# EAGLE schematic Centinel_IO_adap (EAGLE 9.4.2)
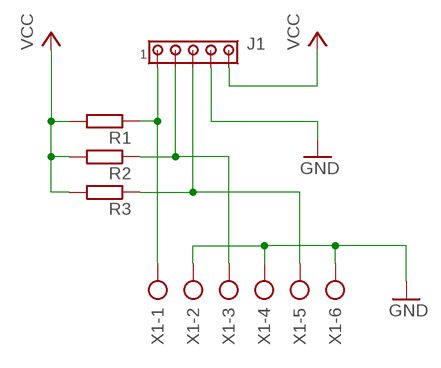
[diagram p0: schematic, sheet 1]

## Parts
J1  MTA05-156  [1X5MTA]
R1  R-EU_0207/7  [0207/7]
R2  R-EU_0207/7  [0207/7]
R3  R-EU_0207/7  [0207/7]
X1  AK500/6  [AK500/6]

## Nets
GND: J1.4 X1.2 X1.4 X1.6
N$1: J1.1 R1.1 X1.1
N$2: J1.2 R2.1 X1.3
N$3: J1.3 R3.1 X1.5
VCC: J1.5 R1.2 R2.2 R3.2

## Library data of the parts
J1 = con-amp:MTA05-156: AMP connector
R1-R3 = rcl:R-EU_: RESISTOR, European symbol; SPICEPREFIX: R
X1 = con-ptr500:AK500/6: CONNECTOR; OC_FARNELL: unknown; OC_NEWARK: unknown